# EAGLE design Tone_Control (EAGLE 6.3)
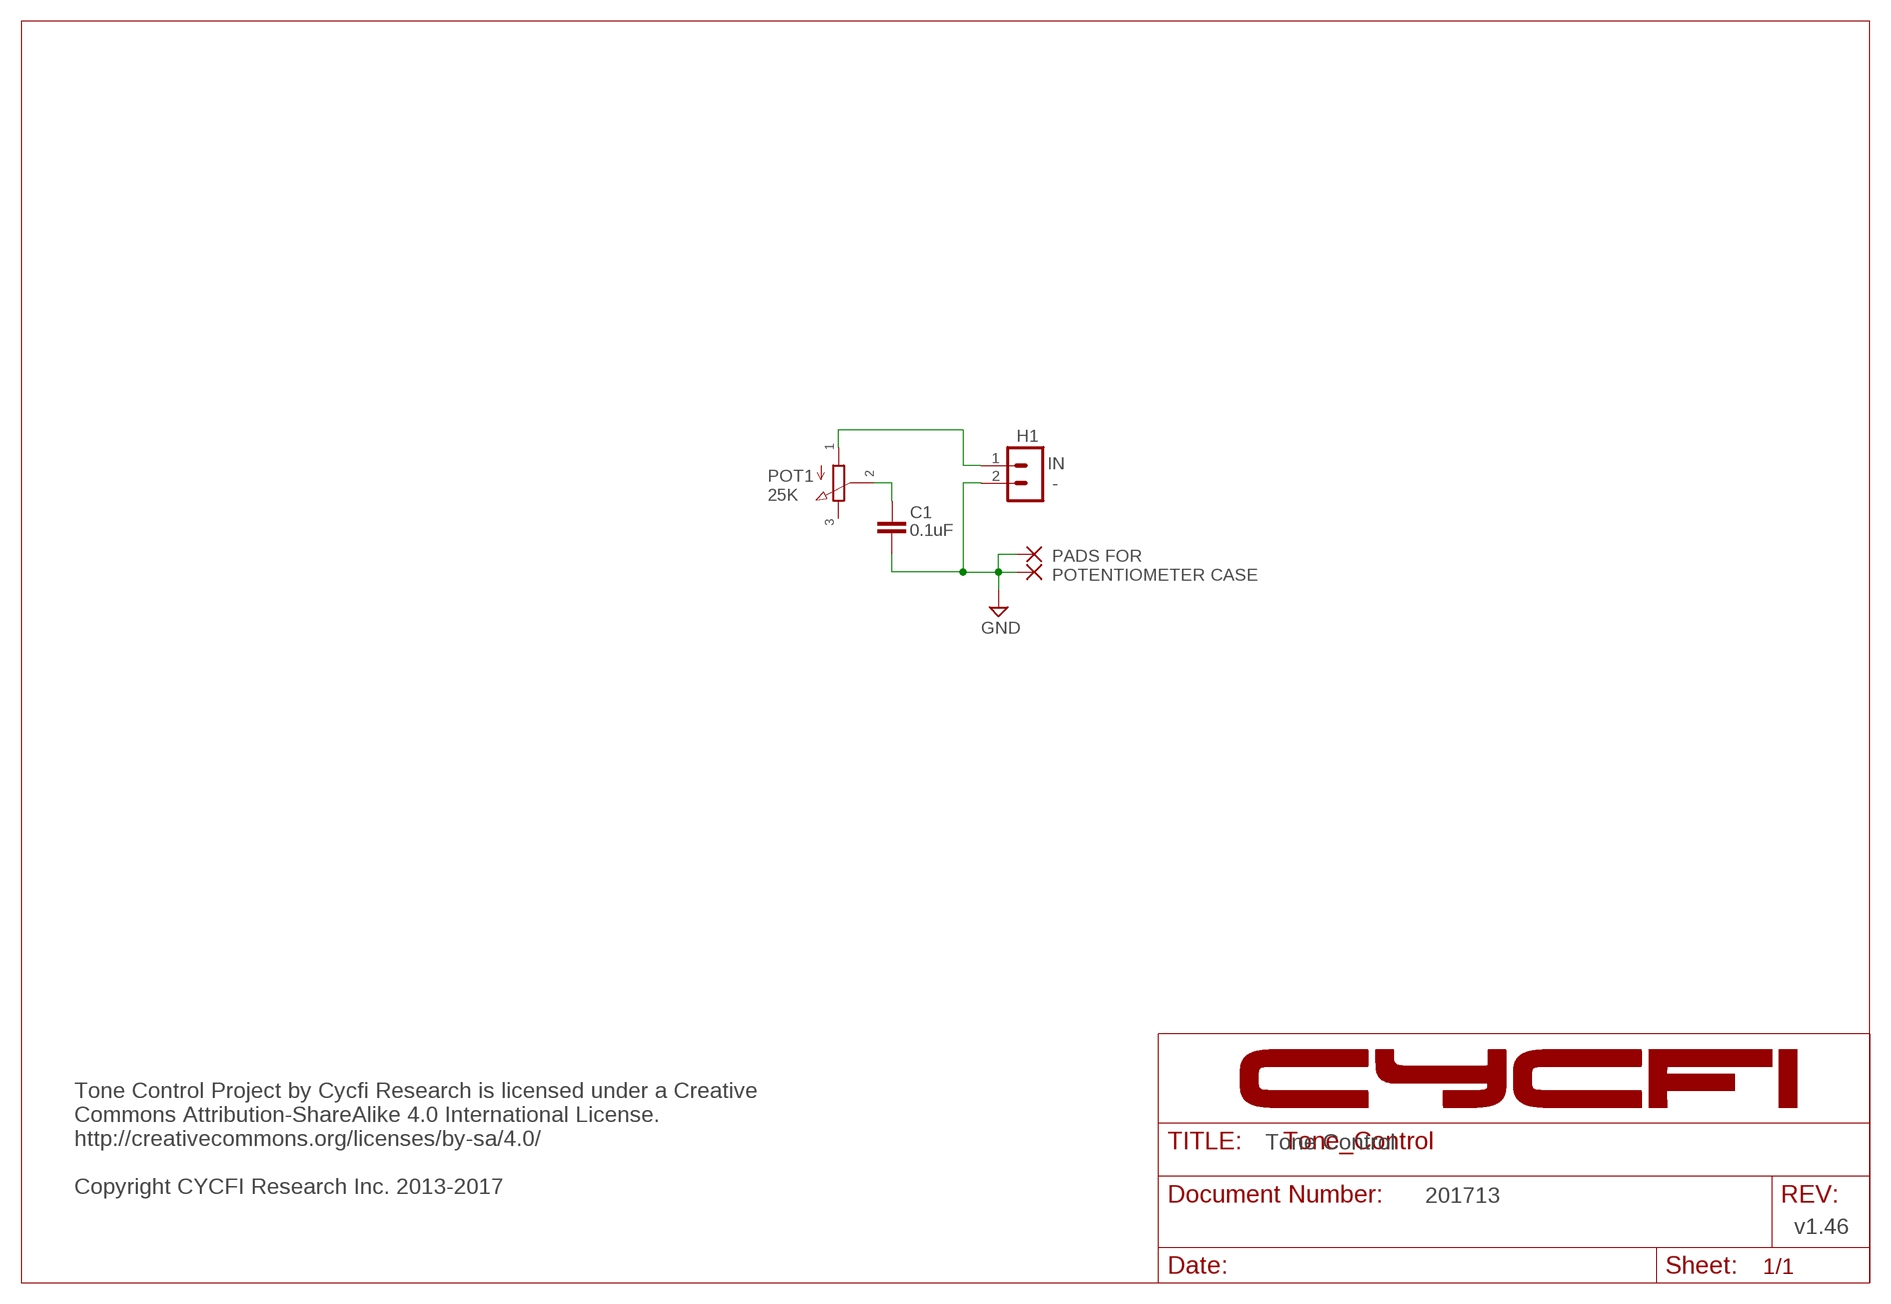
[diagram p0: schematic, sheet 1]

## Parts
C1  0.1uF  C-EUC0603  [C0603]
GND3  SMD2  [SMD1,27-2,54]
GND4  SMD2  [SMD1,27-2,54]
H1  MA02-1  [MA02-1]
POT1  PDB181-GTR01  [PDB181]

## Nets
GND: C1.1 GND3.1(P) GND4.1(P) H1.2
N$1: C1.2 POT1.P$2
N$3: H1.1 POT1.P$1
Unconnected: POT1.P$3

## Notes on the sheet
- IN
- -
- POT1
  25K
- PADS FOR 
  POTENTIOMETER CASE
- Tone Control
- Tone Control Project by Cycfi Research is licensed under a Creative
  Commons Attribution-ShareAlike 4.0 International License. 
  http://creativecommons.org/licenses/by-sa/4.0/
  
  Copyright CYCFI Research Inc. 2013-2017
- 201713
- v1.46

## Library data of the parts
C1 = resistor:C-EU: CAPACITOR, European symbol
GND3 GND4 = wirepad:SMD2: SMD PAD
H1 = con-lstb:MA02-1
POT1 = CYCFI_Passive:PDB181-GTR01

## Board
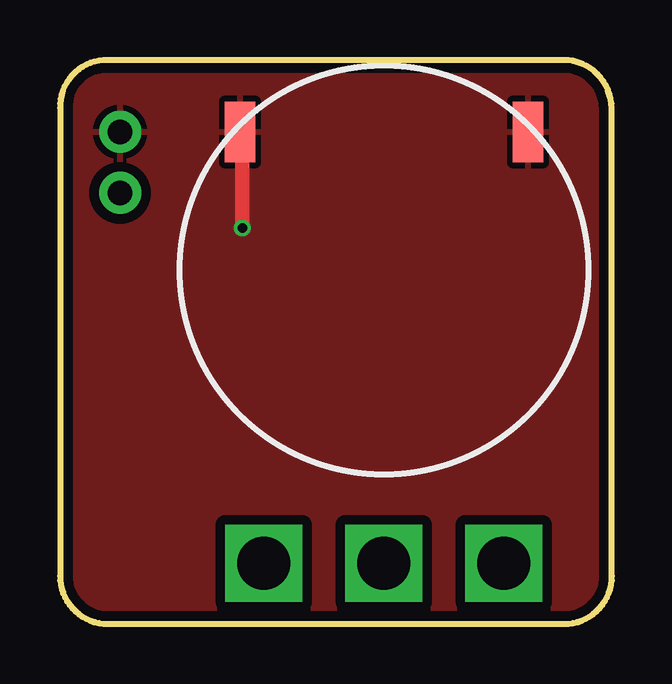
[diagram p1: board, top side]
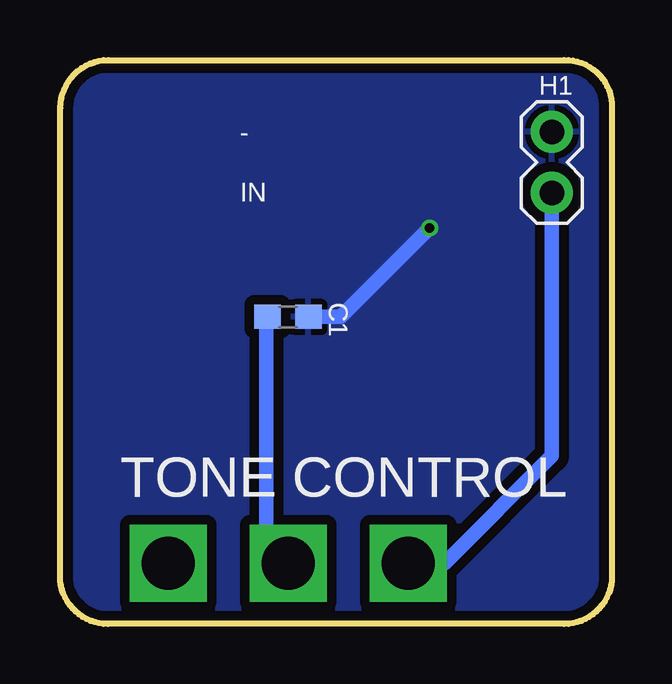
[diagram p2: board, bottom side, seen from below]

Size 23 x 23.5 mm. Coordinates in mm from the lower left corner, seen from the top.
Outline: 0,21.5 0,2 arc90 2,0 21,0 arc90 23,2 22.98,21.5 arc90 20.98,23.5 2,23.5 arc93 0,21.5
Copper layers (1*16): Top 0.035mm / dielectric 1.5mm / Bottom 0.035mm
Design rules "Fusion_eagle_rule_v1.1": minimum track width 6mil, minimum drill 12mil, track to track 6mil, track to pad 6mil, pad to pad 6mil, via to via 6mil, smd to smd 0mil, copper to edge 10mil, drill to drill 10mil, minimum pad ring 10mil, minimum via ring 6mil, stop-mask expansion 2mil, vias tented up to drill 100mil, thermal gap 10mil

### Footprints (pad centres in the part's own frame; a part is rotated, then mirrored left to right if it is on the bottom)
C0603 = smd 1.1 x 1: 1 -0.85,0; 2 0.85,0
SMD1,27-2,54 = smd 1.27 x 2.54: 1 0,0
MA02-1 = drill 1.016 pad 1.75: 1 -2.54,0; 2 0,0
PDB181 = drill 2.2 square: P$1 -5,0; P$2 0,0; P$3 5,0

### Placement (x,y rotation side)
C1  13.5,12.8 180 bottom
GND3  7.5,20.5 0 top
GND4  19.5,20.5 0 top
H1  2.5,20.5 90 bottom
POT1  13.49,2.54 0 top

### Tracks (layer width: path | path; a pad name or v marks a point on that pad's centre or on a via)
GND  (via drill 0.4)
  Top 0.61: v7.6,16.5 7.6,20.5 GND3.1
  Bottom 0.61: C1.1 11.3,12.8 v7.6,16.5
  pour Top (isolate 0.406): 23,21.5 23,2 arc-90 21,0 2,0 arc-90 0,2 0,21.5 arc-90 2,23.5 21,23.5 arc-90
  pour Bottom (isolate 0.406): 23,21.5 23,2 arc-90 21,0 2,0 arc-90 0,2 0,21.5 arc-90 2,23.5 21,23.5 arc-90
N$1
  Bottom 0.61: 14.4,12.75 14.4,3.45 POT1.P$2
  Bottom 0.813: 14.4,12.75 C1.2
N$3
  Bottom 0.61: H1.1 2.5,7 6.96,2.54 POT1.P$1

### Text on the board
bNames: - | IN | TONE CONTROL
_bNames: H1 | H1 | - | IN | C1 | C1 | TONE CONTROL